# Altium schematic sheet Part01_MT7688_RF.SchDoc
size A4
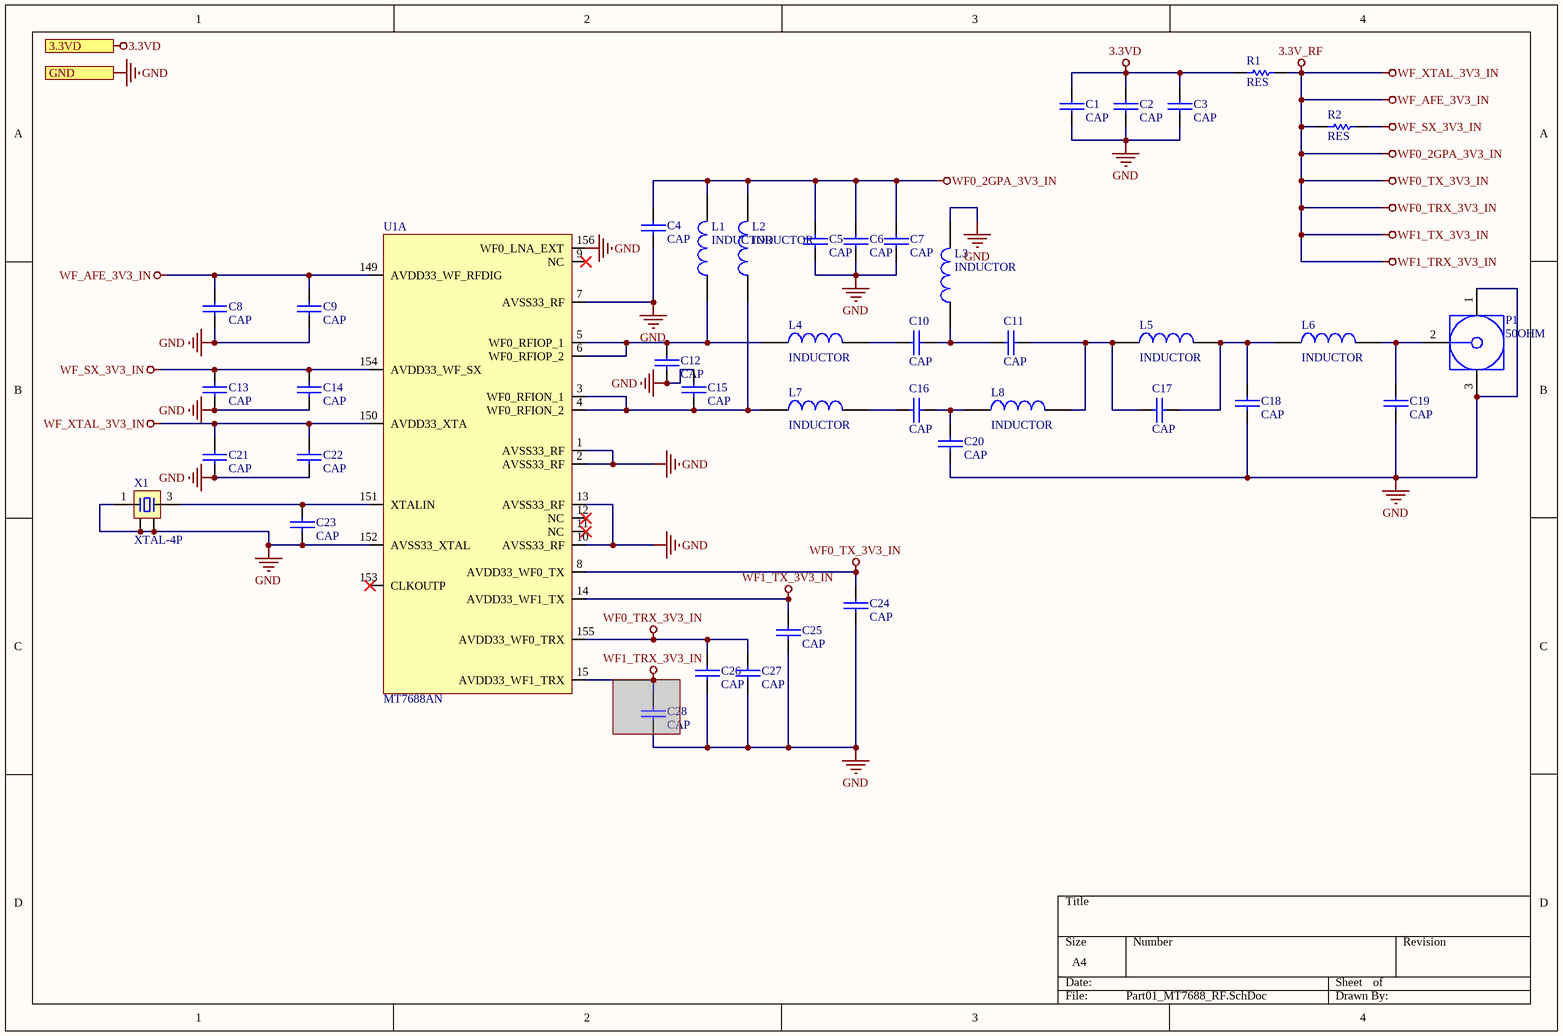
[diagram p0: Part01_MT7688_RF.SchDoc]

## Parts
C1  CAP  [0402C]
C2  CAP  [0402C]
C3  CAP  [0402C]
C4  CAP  [0402C]
C5  CAP  [0402C]
C6  CAP  [0402C]
C7  CAP  [0402C]
C8  CAP  [0402C]
C9  CAP  [0402C]
C10  CAP  [0402C]
C11  CAP  [0402C]
C12  CAP  [0402C]
C13  CAP  [0402C]
C14  CAP  [0402C]
C15  CAP  [0402C]
C16  CAP  [0402C]
C17  CAP  [0402C]
C18  CAP  [0402C]
C19  CAP  [0402C]
C20  CAP  [0402C]
C21  CAP  [0402C]
C22  CAP  [0402C]
C23  CAP  [0402C]
C24  CAP  [0402C]
C25  CAP  [0402C]
C26  CAP  [0402C]
C27  CAP  [0402C]
C28  CAP  [0402C]  (masked out: inside a compile mask, not in the netlist)
L1  INDUCTOR  [0402L]
L2  INDUCTOR  [0402L]
L3  INDUCTOR  [0402L]
L4  INDUCTOR  [0402L]
L5  INDUCTOR  [0402L]
L6  INDUCTOR  [0402L]
L7  INDUCTOR  [0402L]
L8  INDUCTOR  [0402L]
P1  50OHM  [IPEX]
R1  RES  [0603R]
R2  RES  [0402R]
U1  MT7688AN  [MT7628AN$2F$DRQFN156$2F$SMD$2F$P0.5$2F$12X12]  (part A of 6)
X1  XTAL-4P  [OSC 3225-4P]

## Ports
3.3VD, GND

## Nets
3.3V_RF: C4.1 C5.2 C6.2 C7.2 C8.2 C9.2 C21.2 C22.2 C24.1 C25.1 C26.1 C27.1 L1.2 L2.2 R1.2 R2.1 U1.8(AVDD33_WF0_TX) U1.14(AVDD33_WF1_TX) U1.149(AVDD33_WF_RFDIG) U1.150(AVDD33_XTA) U1.155(AVDD33_WF0_TRX)  [also labelled WF0_2GPA_3V3_IN, WF0_TRX_3V3_IN, WF0_TX_3V3_IN, WF1_TRX_3V3_IN, WF1_TX_3V3_IN, WF_AFE_3V3_IN, WF_XTAL_3V3_IN]
3.3VD: C1.2 C2.2 C3.2 R1.1 ; port 3.3VD
GND: C1.1 C2.1 C3.1 C4.2 C5.1 C6.1 C7.1 C8.1 C9.1 C12.1 C13.1 C14.1 C15.2 C18.2 C19.2 C20.2 C21.1 C22.1 C23.1 C24.2 C25.2 C26.2 C27.2 L3.2 P1.1 P1.3 U1.1(AVSS33_RF) U1.2(AVSS33_RF) U1.7(AVSS33_RF) U1.10(AVSS33_RF) U1.13(AVSS33_RF) U1.152(AVSS33_XTAL) U1.156(WF0_LNA_EXT) X1.1 X1.2 X1.4 ; port GND
WF_SX_3V3_IN: C13.2 C14.2 R2.2 U1.154(AVDD33_WF_SX)
NetC10_1: C10.1 C11.2 L3.1
NetC10_2: C10.2 L4.2
NetC11_1: C11.1 C17.2 L5.1 L8.2
NetC12_2: C12.2 L1.1 L4.1 U1.5(WF0_RFIOP_1) U1.6(WF0_RFIOP_2)
NetC15_1: C15.1 L2.1 L7.1 U1.3(WF0_RFION_1) U1.4(WF0_RFION_2)
NetC16_1: C16.1 C20.1 L8.1
NetC16_2: C16.2 L7.2
NetC17_1: C17.1 C18.1 L5.2 L6.1
NetC19_1: C19.1 L6.2 P1.2
NetC23_2: C23.2 U1.151(XTALIN) X1.3

Not connected (* = marked no-connect by the designer): U1 9(NC)* 11(NC)* 12(NC)* 15(AVDD33_WF1_TRX) 153(CLKOUTP)*

## Library data of the parts
C1-C28 = CAP: 无极性电容
P1 = IPEX: RF Coaxial PCB Connector, MCX; Thru-Hole, Right-Angle Mount Socket, Blunt Post Terminal, 50 Ohm Impedance; PCB_Layout: Complies with manufacturer's recommendation.; DrillSize: Corresponds to nominal value.; Published: 15-Jul-2004; LatestRevisionDate: 15-Jul-2004; LatestRevisionNote: Component Replaced.; DatasheetDocument: 30-May-2003; PackageDocument: 04-Jul-1999; PackageReference: 919-119J-51AX; Publisher: Altium Limited; ComponentLink1Description: Manufacturer Link; ComponentLink1URL: http://www.amphenolrf.com/
X1 = XTAL-4P: 4脚无源晶振